# Altium project Nixie_Tube_Clock_Rev1.PrjPcb
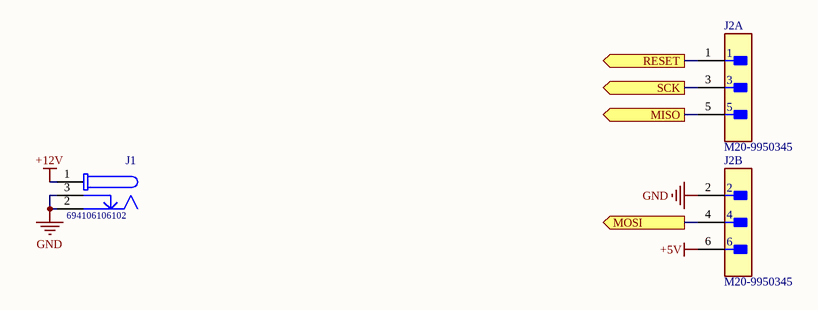
[diagram p0: Connectors.SchDoc]
3 sheets, 19 parts. Net scope: flat (ports and power ports of the same name join across sheets).
Board file: HV_Boost.PcbDoc
Sheets:
  Connectors.SchDoc
  ATMega1284p.SchDoc
  MIC4690YM-TR.SchDoc

## Sheet Connectors.SchDoc
size A; SheetNumber: 1; SheetTotal: 7

### Parts
J1  694106106102  [694106106102]
J2  M20-9950345  [FP-M20-9950345-MFG]  (parts A,B of 2)

### Ports
MISO (out), MOSI (out), RESET (out), SCK (out)

### Nets
+5V: J2.6
+12V: J1.1
GND: J1.2 J1.3 J2.2
NetJ2_1: J2.1 ; port RESET
NetJ2_3: J2.3 ; port SCK
NetJ2_4: J2.4 ; port MOSI
NetJ2_5: J2.5 ; port MISO

### Library data of the parts
J1 = CMP-1502-00177-1: DC Power Jack Connector with 4 soldering pads & Pegs WR-DC, Male, Right Angled, SMT, 5 A, 24 V; Manufacturer: Wurth Elektronik; Working Voltage: 24V; Rated Current: 5A; Plug Inner Diameter: 2.05mm; Plug Outer Diameter: 5.5mm; Opening Diameter: 6.4mm; Packaging: TapeandReel; Package Reference: 694106106102; Datasheet URL: http://katalog.we-online.de/em/datasheet/6941xx106102.pdf; Operating Temperature: -40to85degC; Orientation: RightAngled; Part Number: 694106106102; Mounting Technology: SMT; Publisher: WurthElektronik; Manufacturer URL: http://www.we-online.de; Gender: Male
J2 = CMP-15831-000002-1: CONN HEADER R/A 6POS 2.54MM; Manufacturer: Harwin; Conn Gender: Male; Number Of Contacts: 6; Conn Orientation: Right Angle; Current Rating: 3A; Device Class L2: Headers and Wire Housings; Temperature: -40°C to +105°C; Device Class L1: Connectors; RoHS: TRUE; Temperature Range Low: -40°C; ComponentLink2URL: https://cdn.harwin.com/pdfs/M20-995.pdf; Height: 5.28mm; Digikey Description: CONN HEADER R/A 6POS 2.54MM; Pitch: 2.54mm; Manufacturer Part Number: M20-9950345; Device Class L3: unset; Ipc Land Pattern Name: DFN400X400X80-14; Automotive: No; Octopart: https://octopart.com/m20-9950345-harwin-21265213; Category: Conn; Mouser Description: Headers & Wire Housings 03+03 DIL HORIZONTAL PIN HEADER GOLD HT; Package: 0; Number Of Rows: 2; Contact Material: Gold,Nickel; Lead Free: Yes; ComponentLink2Description: Datasheet; Temperature Range High: +105°C

## Sheet ATMega1284p.SchDoc
size A; SheetNumber: 3; SheetTotal: 7
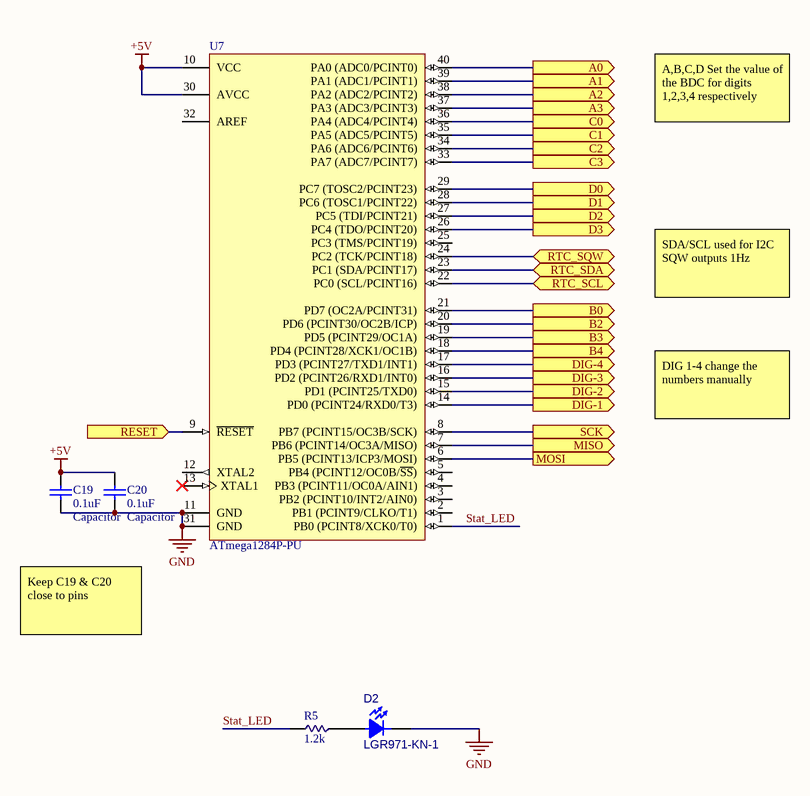
[diagram p1: ATMega1284p.SchDoc]

### Parts
C19  value 0.1uF  Type: Capacitor  [FOOTPRINT-1206-GEN]  (hidden comment: Capacitor - 0.1uF - 1206)
C20  value 0.1uF  Type: Capacitor  [FOOTPRINT-1206-GEN]  (hidden comment: Capacitor - 0.1uF - 1206)
D2  LGR971-KN-1  [FOOTPRINT-OSRAM-CHIPLED-0805-1A2K]
R5  value 1.2k  [FOOTPRINT-0805-GEN]  (hidden comment: RMCF0805FT1K20)
U7  ATmega1284P-PU  [40P6]

### Ports
A0 (out), A1 (out), A2 (out), A3 (out), B0 (out), B2 (out), B3 (out), B4 (out), C0 (out), C1 (out), C2 (out), C3 (out), D0 (out), D1 (out), D2 (out), D3 (out), DIG-1 (out), DIG-2 (out), DIG-3 (out), DIG-4 (out), MISO (out), MOSI (out), RESET (in), RTC_SCL (bidir), RTC_SDA (bidir), RTC_SQW (bidir), SCK (out)

### Nets
+5V: C19.2 C20.2 U7.10(VCC) U7.30(AVCC)
GND: C19.1 C20.1 D2.2(K) U7.11(GND) U7.31(GND)
Stat_LED: R5.2 U7.1(PB0_(PCINT8/XCK0/T0))
NetD2_1: D2.1(A) R5.1
NetJ2_1: U7.9(~{RESET}) ; port RESET
NetJ2_3: U7.8(PB7_(PCINT15/OC3B/SCK)) ; port SCK
NetJ2_4: U7.6(PB5_(PCINT13/ICP3/MOSI)) ; port MOSI
NetJ2_5: U7.7(PB6_(PCINT14/OC3A/MISO)) ; port MISO
NetU7_14: U7.14(PD0_(PCINT24/RXD0/T3)) ; port DIG-1
NetU7_15: U7.15(PD1_(PCINT25/TXD0)) ; port DIG-2
NetU7_16: U7.16(PD2_(PCINT26/RXD1/INT0)) ; port DIG-3
NetU7_17: U7.17(PD3_(PCINT27/TXD1/INT1)) ; port DIG-4
NetU7_18: U7.18(PD4_(PCINT28/XCK1/OC1B)) ; port B4
NetU7_19: U7.19(PD5_(PCINT29/OC1A)) ; port B3
NetU7_20: U7.20(PD6_(PCINT30/OC2B/ICP)) ; port B2
NetU7_21: U7.21(PD7_(OC2A/PCINT31)) ; port B0
NetU7_22: U7.22(PC0_(SCL/PCINT16)) ; port RTC_SCL
NetU7_23: U7.23(PC1_(SDA/PCINT17)) ; port RTC_SDA
NetU7_24: U7.24(PC2_(TCK/PCINT18)) ; port RTC_SQW
NetU7_26: U7.26(PC4_(TDO/PCINT20)) ; port D3
NetU7_27: U7.27(PC5_(TDI/PCINT21)) ; port D2
NetU7_28: U7.28(PC6_(TOSC1/PCINT22)) ; port D1
NetU7_29: U7.29(PC7_(TOSC2/PCINT23)) ; port D0
NetU7_33: U7.33(PA7_(ADC7/PCINT7)) ; port C3
NetU7_34: U7.34(PA6_(ADC6/PCINT6)) ; port C2
NetU7_35: U7.35(PA5_(ADC5/PCINT5)) ; port C1
NetU7_36: U7.36(PA4_(ADC4/PCINT4)) ; port C0
NetU7_37: U7.37(PA3_(ADC3/PCINT3)) ; port A3
NetU7_38: U7.38(PA2_(ADC2/PCINT2)) ; port A2
NetU7_39: U7.39(PA1_(ADC1/PCINT1)) ; port A1
NetU7_40: U7.40(PA0_(ADC0/PCINT0)) ; port A0

Not connected (* = marked no-connect by the designer): U7 2(PB1_(PCINT9/CLKO/T1)) 3(PB2_(PCINT10/INT2/AIN0)) 4(PB3_(PCINT11/OC0A/AIN1)) 5(PB4_(PCINT12/OC0B/~{SS})) 12(XTAL2) 13(XTAL1)* 25(PC3_(TMS/PCINT19)) 32(AREF)

### Notes on the sheet
- A,B,C,D Set the value of the BDC for digits 1,2,3,4 respectively
- SDA/SCL used for I2C
  SQW outputs 1Hz
- DIG 1-4 change the numbers manually
- Keep C19 & C20 close to pins

### Library data of the parts
C19 C20 = CMP-001-00096-1: CAP CER 0.1UF 50V X7R 1206; Part Number: 1276-7034-1-ND; PackageReference: RAD-0.3; Published: 8-Jun-2000; Source: Generic.SchLib; Design Item ID: Capacitor-Generic-1206; LatestRevisionNote: Re-released for DXP Platform.; PackageDescription: Radial Cap, Thru-Hole; 2 Leads; 0.3 in Pin Spacing; Publisher: Altium Limited
D2 = CMP-017-000003-2: LED Uni-Color Green 572nm 2-Pin Chip 0805(2012Metric) T/R; Part Number: 475-1410-1-ND; Current - Maximum: 25mA; Current - Test: 20mA; Forward Voltage: 2.2V; Design Item ID: LED-OSRAM-LG-R971-KN-1; Source: Discrete.SchLib
R5 = CMP-009-00185-2: Res Thick Film 0805 1.2K Ohm 1% 0.125W ±100ppm/°C Molded SMD Paper T/R; Design Item ID: Resistor-Generic-0805-2012; Source: Generic.SchLib; Type: Resistor
U7 = CMP-0107-00007-2: 8-bit AVR Microcontroller, 128KB Flash, 4KB EEPROM, 16KB SRAM, 40-pin PDIP, Industrial Grade (-40°C to 85°C); ComponentLink2Description: ATmega164A/164PA/324A/324PA/644A/644PA/1284/1284P Datasheet; PackageReference: 40P6; PackageVersion: revB, Sep-2001; PackageDescription: 40-lead (0.600"/15.24mm Wide) Plastic Dual Inline Package (PDIP); Code_JEDEC: MS-011-AC; ComponentLink1Description: Manufacturer URL; ComponentLink3Description: ATmega164A/164PA/324A/324PA/644A/644PA/1284/1284P Summary; ComponentLink3URL: http://www.atmel.com/dyn/resources/prod_documents/8272S.pdf; DatasheetVersion: revC, Jun-2011; ComponentLink2URL: http://www.atmel.com/dyn/resources/prod_documents/doc8272.pdf; ComponentLink1URL: http://www.atmel.com/

## Sheet MIC4690YM-TR.SchDoc
size A; SheetNumber: 5; SheetTotal: 7
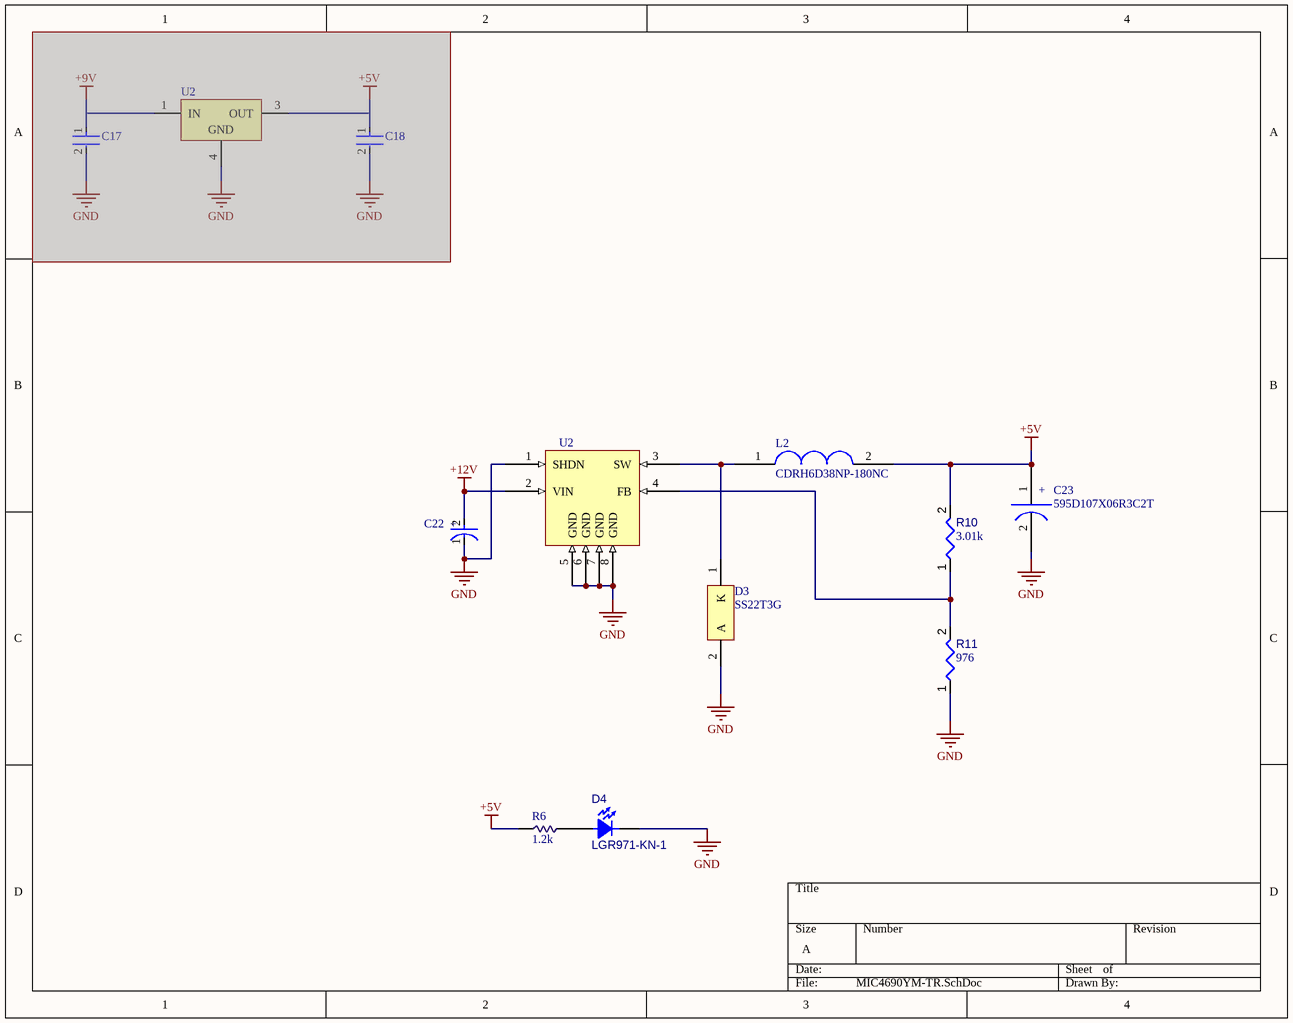
[diagram p2: MIC4690YM-TR.SchDoc]

### Parts
(Parts that share a designator on the sheet are numbered #1, #2 ... from top to bottom, then left to right.)
C17  C1206C334K1RACTU  [FP-C1206C-EB-MFG]  (value not drawn)  (masked out: inside a compile mask, not in the netlist)
C18  C1206C104K1RACTU  [FP-C1206C-EB-MFG]  (value not drawn)  (masked out: inside a compile mask, not in the netlist)
C22  47uF  [FP-T528Z477M2R5ATE008-MFG]  (value not drawn)
C23  595D107X06R3C2T  [595D107X06R3C2T]
D3  SS22T3G  [ONSC-SMB-2-403A-03_V]
D4  LGR971-KN-1  [FOOTPRINT-OSRAM-CHIPLED-0805-1A2K]
L2  CDRH6D38NP-180NC  [CDRH6D38NP-180NC]
R6  value 1.2k  [FOOTPRINT-0805-GEN]  (hidden comment: RMCF0805FT1K20)
R10  value 3.01k  [RESC3216X60X45ML15T20]  (hidden comment: Resistor 3.01k +/-1% 1206 250 mW)
R11  value 976  [RESC3216X60X45ML15T20]  (hidden comment: Resistor 976 +/-1% 1206 250 mW)
U2#1  L7805CD2T-TR  [TO-263_M]  (value not drawn)  (masked out: inside a compile mask, not in the netlist)
U2#2  MIC4690YM-TR  [TPS5402]  (value not drawn)

### Nets
+5V: C23.1 L2.2 R6.2 R10.2
+12V: C22.2(A) U2#2.2(VIN)
GND: C22.1(C) C23.2 D3.2(A) D4.2(K) R11.1 U2#2.1(SHDN) U2#2.5(GND) U2#2.6(GND) U2#2.7(GND) U2#2.8(GND)
NetD3_1: D3.1(K) L2.1 U2#2.3(SW)
NetD4_1: D4.1(A) R6.1
NetR10_1: R10.1 R11.2 U2#2.4(FB)

### Notes on the sheet
- (in symbol 595D107X06R3C2T) +
- (in symbol CMP-03017-000005-1) +

### Library data of the parts
C17 = CMP-1037-04498-2: CAP CER 0.33UF 100V X7R 1206 / C1206C334K1RACTU; Manufacturer: KEMET; Material: Ceramic; Value: 0.33 μF; Automotive Grade: Grade 0; Temperature Coefficient: 15%; Tolerance: 0.1; Voltage Rating: 100 V; Height: 0.88mm; Device Class L1: Passive Components; Device Class L2: Capacitors; Package: C1206C-EB; Lead Free: Yes; Mouser Description: Cap Ceramic 0.33uF 100V X7R 10% SMD 1206 125°C Plastic T/R; ComponentLink2URL: https://content.kemet.com/datasheets/KEM_C1007_X8R_ULTRA_150C_SMD.pdf; Digikey Description: CAP CER 0.33UF 100V X7R 1206; Category: Cap; Automotive: Yes; Temperature Range Low: -55°C; Ipc Land Pattern Name: CAPC320160X78; Manufacturer Part Number: C1206C334K1RACTU; Temperature: -55°C to +150°C; Temperature Range High: +150°C; RoHS: TRUE; Device Class L3: Ceramic Capacitors; Octopart: https://octopart.com/c1206c334k1ractu-kemet-9144123; Capacitance: 0.33 μF; Temperature Characteristic: X7R; ComponentLink2Description: Datasheet
C18 = CMP-03020-000153-1: CAP CER 0.1UF 100V X7R 1206 / C1206C104K1RACTU; Manufacturer: KEMET; Value: 0.10 μF; Tolerance: 0.1; Material: Ceramic; Temperature Coefficient: 15%; Automotive Grade: Grade 0; Voltage Rating: 100 V; Automotive: Yes; Ipc Land Pattern Name: CAPC320160X78; Device Class L1: Passive Components; ComponentLink2Description: Datasheet; Temperature Range Low: -55°C; Category: Cap; Octopart: https://octopart.com/c1206c104k1ractu-kemet-89521; Height: 0.88mm; Lead Free: Yes; Digikey Description: CAP CER 0.1UF 100V X7R 1206; Mouser Description: CAP CER 0.1UF 100V X7R 1206; Device Class L3: Ceramic Capacitors; Device Class L2: Capacitors; ComponentLink2URL: https://content.kemet.com/datasheets/KEM_C1007_X8R_ULTRA_150C_SMD.pdf; Temperature Range High: +150°C; Temperature Characteristic: X7R; Manufacturer Part Number: C1206C104K1RACTU; RoHS: TRUE; Capacitance: 0.10 μF; Package: C1206C-EB; Temperature: -55°C to +150°C
C22 = CMP-03017-000005-1: CAP TANT 47UF 20% 20V 2917 / 595D476X0020D2T; Voltage Rating (DC): 2.5V; Ripple Current: 6.4A; Dissipation Factor: 10%; ESR (Equivalent Series Resistance): 8mR; Capacitance: 470uF; Leakage Current: 118uA; Polarity: Polar; Max Operating Temperature: 105°C; RoHS Compliant: Yes; Mount: Surface Mount; Depth: 4.3mm; Voltage Rating: 2.5V; Width: 0.169inch; Package Quantity: 1; Height: 1.7mm; Packaging: Tape and Reel; Features: General Purpose; Termination: SMD/SMT; Case/Package: 2917; Min Operating Temperature: -55°C; Height - Seated (Max): 0.067inch; Case Code (Imperial): 2917; Case Code (Metric): 7343; Length: 7.3mm; Construction: Flat; Series: KO-CAP T528; Tolerance: 20%; REACH SVHC: No SVHC
C23 = 595D107X06R3C2T: 595D107X06R3C2T / 100uF, 6.3V
D3 = CMP-1055-00373-1: Schottky Power Rectifier, 2-Pin SMB, Pb-Free, Tape and Reel; Manufacturer: On Semiconductor; IFSM Max (A): 75; Configuration: Single; DatasheetVersion: Rev. 4; PackageVersion: Rev. J, 07/2012; ComponentLink3Description: Package Specification; ComponentLink2Description: Datasheet; PackageDescription: 2-Pin Small Molded Package, J-Bend Lead, Body 4.33 x 3.625 mm; Mounting Technology: Surface Mount; PartNumber: SS22T3G; ComponentLink3URL: http://www.onsemi.com/pub_link/Collateral/403A-03.PDF; Packing: Tape and Reel; ComponentLink1URL: http://www.onsemi.com/; ComponentLink2URL: http://www.onsemi.cn/pub_link/Collateral/SS24-D.PDF; PackageReference: SMB-2-403A-03; RoHS: TRUE; ComponentLink1Description: Manufacturer URL
D4 = CMP-017-000003-2: as D2 on sheet ATMega1284p; Design Item ID: LED-OSRAM-LG-R971-KN-1; Source: Discrete.SchLib
R6 = CMP-009-00185-2: as R5 on sheet ATMega1284p; Design Item ID: Resistor-Generic-0805-2012; Source: Generic.SchLib; Type: Resistor
R10 = CMP-009-00016-4: Chip Resistor, 3.01KOhm, +/- 1%, 0.25 W, -55 to 155 degC, 1206 (3216 Metric); Power: 250mW; Voltage Rating: 200V; Max Operating Temperature: 155°C; Mounting Technology: SM; Case/Package: 1206; Pins: 2; Min Operating Temperature: -55°C; RoHS Compliant: True; Tolerance: 1%
R11 = CMP-009-00016-4: Chip Resistor, 976Ohm, +/- 1%, 0.25 W, -55 to 155 degC, 1206 (3216 Metric); Power: 250mW; Voltage Rating: 200V; Max Operating Temperature: 155°C; Mounting Technology: SM; Case/Package: 1206; Pins: 2; Min Operating Temperature: -55°C; RoHS Compliant: True; Tolerance: 1%
U2#1 = CMP-0244-00213-1: Positive Voltage Regulator, 3-Pin D2PAK, Tape and Reel / L7805CD2T-TR; PackageReference: TO-263; ComponentLink2URL: http://www.st.com/internet/com/TECHNICAL_RESOURCES/TECHNICAL_LITERATURE/DATASHEET/CD00000444.pdf; PackageDescription: 3-Pin Transistor Outline Package 2.54 mm Pitch, 15.4 mm Lead Span (D2PAK); DatasheetVersion: 16/11/2011; ComponentLink2Description: Datasheet; ComponentLink1Description: Manufacturer URL; PackageVersion: 2011; ComponentLink1URL: http://www.st.com

## Nets that join several sheets
+5V: Connectors (J2.6), ATMega1284p (C19.2 C20.2 U7.10 U7.30), MIC4690YM-TR (C23.1 L2.2 R6.2 R10.2)
+12V: Connectors (J1.1), MIC4690YM-TR (C22.2 U2#2.2)
GND: Connectors (J1.2 J1.3 J2.2), ATMega1284p (5 pins), MIC4690YM-TR (10 pins)
NetJ2_1: Connectors (J2.1), ATMega1284p (U7.9)
NetJ2_3: Connectors (J2.3), ATMega1284p (U7.8)
NetJ2_4: Connectors (J2.4), ATMega1284p (U7.6)
NetJ2_5: Connectors (J2.5), ATMega1284p (U7.7)